# Altium schematic sheet UI.SchDoc: Plant - UI
size A4; Author: Carlos de la Fuente; CompanyName: eKuore; DrawnBy: Carlos de la Fuente; Engineer: Carlos de la Fuente; Organization: eKuore; Revision: 0.2; SheetNumber: 5; SheetTotal: 5
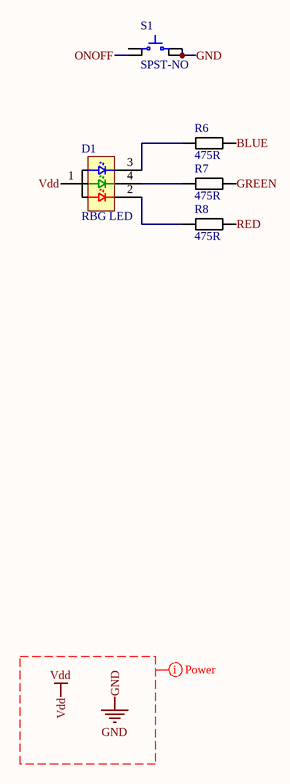
[diagram p0: UI.SchDoc]

## Parts
D1  RBG LED  [LED 0101/0404 RGB]
R6  475R  [RES 0402/1005]
R7  475R  [RES 0402/1005]
R8  475R  [RES 0402/1005]
S1  SPST-NO  [Panasonic evqp7]

## Nets
GND: S1.2 S1.2'
Vdd: D1.1(A)
BLUE: R6.2
GREEN: R7.2
ONOFF: S1.1'
RED: R8.2
NetD1_2: D1.2(C2) R8.1
NetD1_3: D1.3(C3) R6.1
NetD1_4: D1.4(C4) R7.1

Not connected (* = marked no-connect by the designer): S1 1

## Layout directives
net class Power: GND, Vdd

## Notes on the sheet
- Title
- Size:
- Date:
- A4
- Project:
- Time:
- Sheet
- Drawn By:
- Revision:
- of
- File:

## Library data of the parts
D1 = SML-LX0404SIUPGUSB: LED 0404 RBG; Manufacturer: Lumex; Value: RGB; Color: Blue; Viewing Angle: 120°; Forward Current: 2mA; Forward Voltage: 2.73V; Luminous Intensity: 20mcd; Lens Style: Square; Number of LEDs: 3; Power Rating: 30mW; Lens Color: Colorless; Lens Transparency: Clear; Wavelength: 465nm; Part Number: SML-LX0404SIUPGUSB; Revision Date: 08/05/2019; Creation Date: 06/05/2019; Supplier 1: Digi-Key; Supplier Part Number 1: 67-2125-1-ND; Manufacturer Part Number: SML-LX0404SIUPGUSB; Stock 1: 106243; Pricing 1: 1 = 1,29000, 10 = 1,04700, 25 = 0,80560, 100 = 0,7; RoHS: Yes; Mount: Surface Mount; Case/Package: 0404; Case Code (Metric): 1010; Case Code (Imperial): 0404; Min Operating Temperature: -40°C; Max Operating Temperature: 85°C; Package Quantity: 2000; Packaging: Tape and Reel; Test Current: 2mA; Length: 1mm; Height: 0.3mm; Width: 1mm; Lead Free: Lead Free; ComponentLink1URL: https://datasheet.ciiva.com/1333/lumex-quasarbrite; ComponentLink1Description: https://datasheet.ciiva.com/1333/lumex-quasarbrite; ComponentLink2URL: https://datasheet.ciiva.com/4689/sml-lx0404siupgus; ComponentLink2Description: https://datasheet.ciiva.com/4689/sml-lx0404siupgus; ComponentLink3URL: https://datasheet.ciiva.com/1246/1423960-1246392.p; ComponentLink3Description: https://datasheet.ciiva.com/1246/1423960-1246392.p; ComponentLink4URL: https://datasheet.ciiva.com/2118/sml-lx0404siupgus; ComponentLink4Description: https://datasheet.ciiva.com/2118/sml-lx0404siupgus; ComponentLink5URL: https://datasheet.ciiva.com/16199/sml-lx0404siupgu; ComponentLink5Description: https://datasheet.ciiva.com/16199/sml-lx0404siupgu; ComponentLink6URL: https://datasheet.ciiva.com/14604/70127422-1460494; ComponentLink6Description: https://datasheet.ciiva.com/14604/70127422-1460494; REACH SVHC: No SVHC; ComponentLink7URL: https://datasheet.ciiva.com/1246/1484526-1246779.p; ComponentLink7Description: https://datasheet.ciiva.com/1246/1484526-1246779.p; ComponentLink8URL: https://datasheet.ciiva.com/2118/sml-lx0404siupgus; ComponentLink8Description: https://datasheet.ciiva.com/2118/sml-lx0404siupgus; ComponentLink9URL: https://datasheet.ciiva.com/2118/sml-lx0404siupgus; ComponentLink9Description: https://datasheet.ciiva.com/2118/sml-lx0404siupgus
R6-R8 = RC0402FR-07475RL: RES 0402 475R 1%  63mW; Manufacturer: Yageo; Note: recommended; Voltage Rating (DC): 50V; Power Rating: 62.5mW; Value: 475R; Part Number: RC0402FR-07475RL; Creation Date: 06/05/2019; Revision Date: 08/05/2019; Supplier 1: Digi-Key; Supplier Part Number 1: 311-475LRCT-ND; Manufacturer Part Number: RC0402FR-07475RL; Stock 1: 2078167; Pricing 1: 1 = 0,10000, 10 = 0,01600, 100 = 0,00670, 1000 = 0,00301, 2500 = 0,00261, 5000 = 0,00215 (USD); RoHS: No; Case/Package: 0402; Tolerance: 1%; Resistance: 475R; Packaging: Cut Tape; Length: 1mm; Lead Free: Lead Free; ComponentLink1URL: http://www.yageo.com/documents/recent/PYu-RC_Group_51_RoHS_L_10.pdf?src-supplier=Digi-Key; ComponentLink1Description: http://www.yageo.com/documents/recent/PYu-RC_Group_51_RoHS_L_10.pdf?src-supplier=Digi-Key
S1 = EVQ-P7A01P: Switch Tactile N.O. SPST Right Angle 0.05A 12V; Manufacturer: Panasonic; Mechanical Life: 100000Cycles; Operating Force: 2.2N; Illumination Type: Non-Illuminated; Switch Travel: 0.2mm; Switch Function: Off-Mom; Contact Resistance: 500mR; Contact Current Rating: 50mA; Actuator Length: 0.65mm; Part Number: EVQ-P7A01P; Revision Date: 08/05/2019; Creation Date: 08/05/2019; Supplier 1: Digi-Key; Supplier Part Number 1: P16763CT-ND; Manufacturer Part Number: EVQ-P7A01P; Stock 1: 641; RoHS: Yes; Mount: Surface Mount; Case/Package: SMD/SMT; Min Operating Temperature: -20°C; Max Operating Temperature: 70°C; Packaging: Tape and Reel; Throw Configuration: SPST; Termination: Gull Wing; Package Quantity: 1; Orientation: Right Angle; ComponentLink1URL: https://datasheet.ciiva.com/30108/atk0000ce20-3010; ComponentLink1Description: https://datasheet.ciiva.com/30108/atk0000ce20-3010; Pricing 1: 1=0,30000, 10=0,28800, 25=0,27840, 50=0,26860, 100; Max Voltage Rating (DC): 12V; Electrical Life: 100000Cycles; Radiation Hardening: No; REACH SVHC: Unknown